# Altium schematic sheet Sheet1.SchDoc
size A3
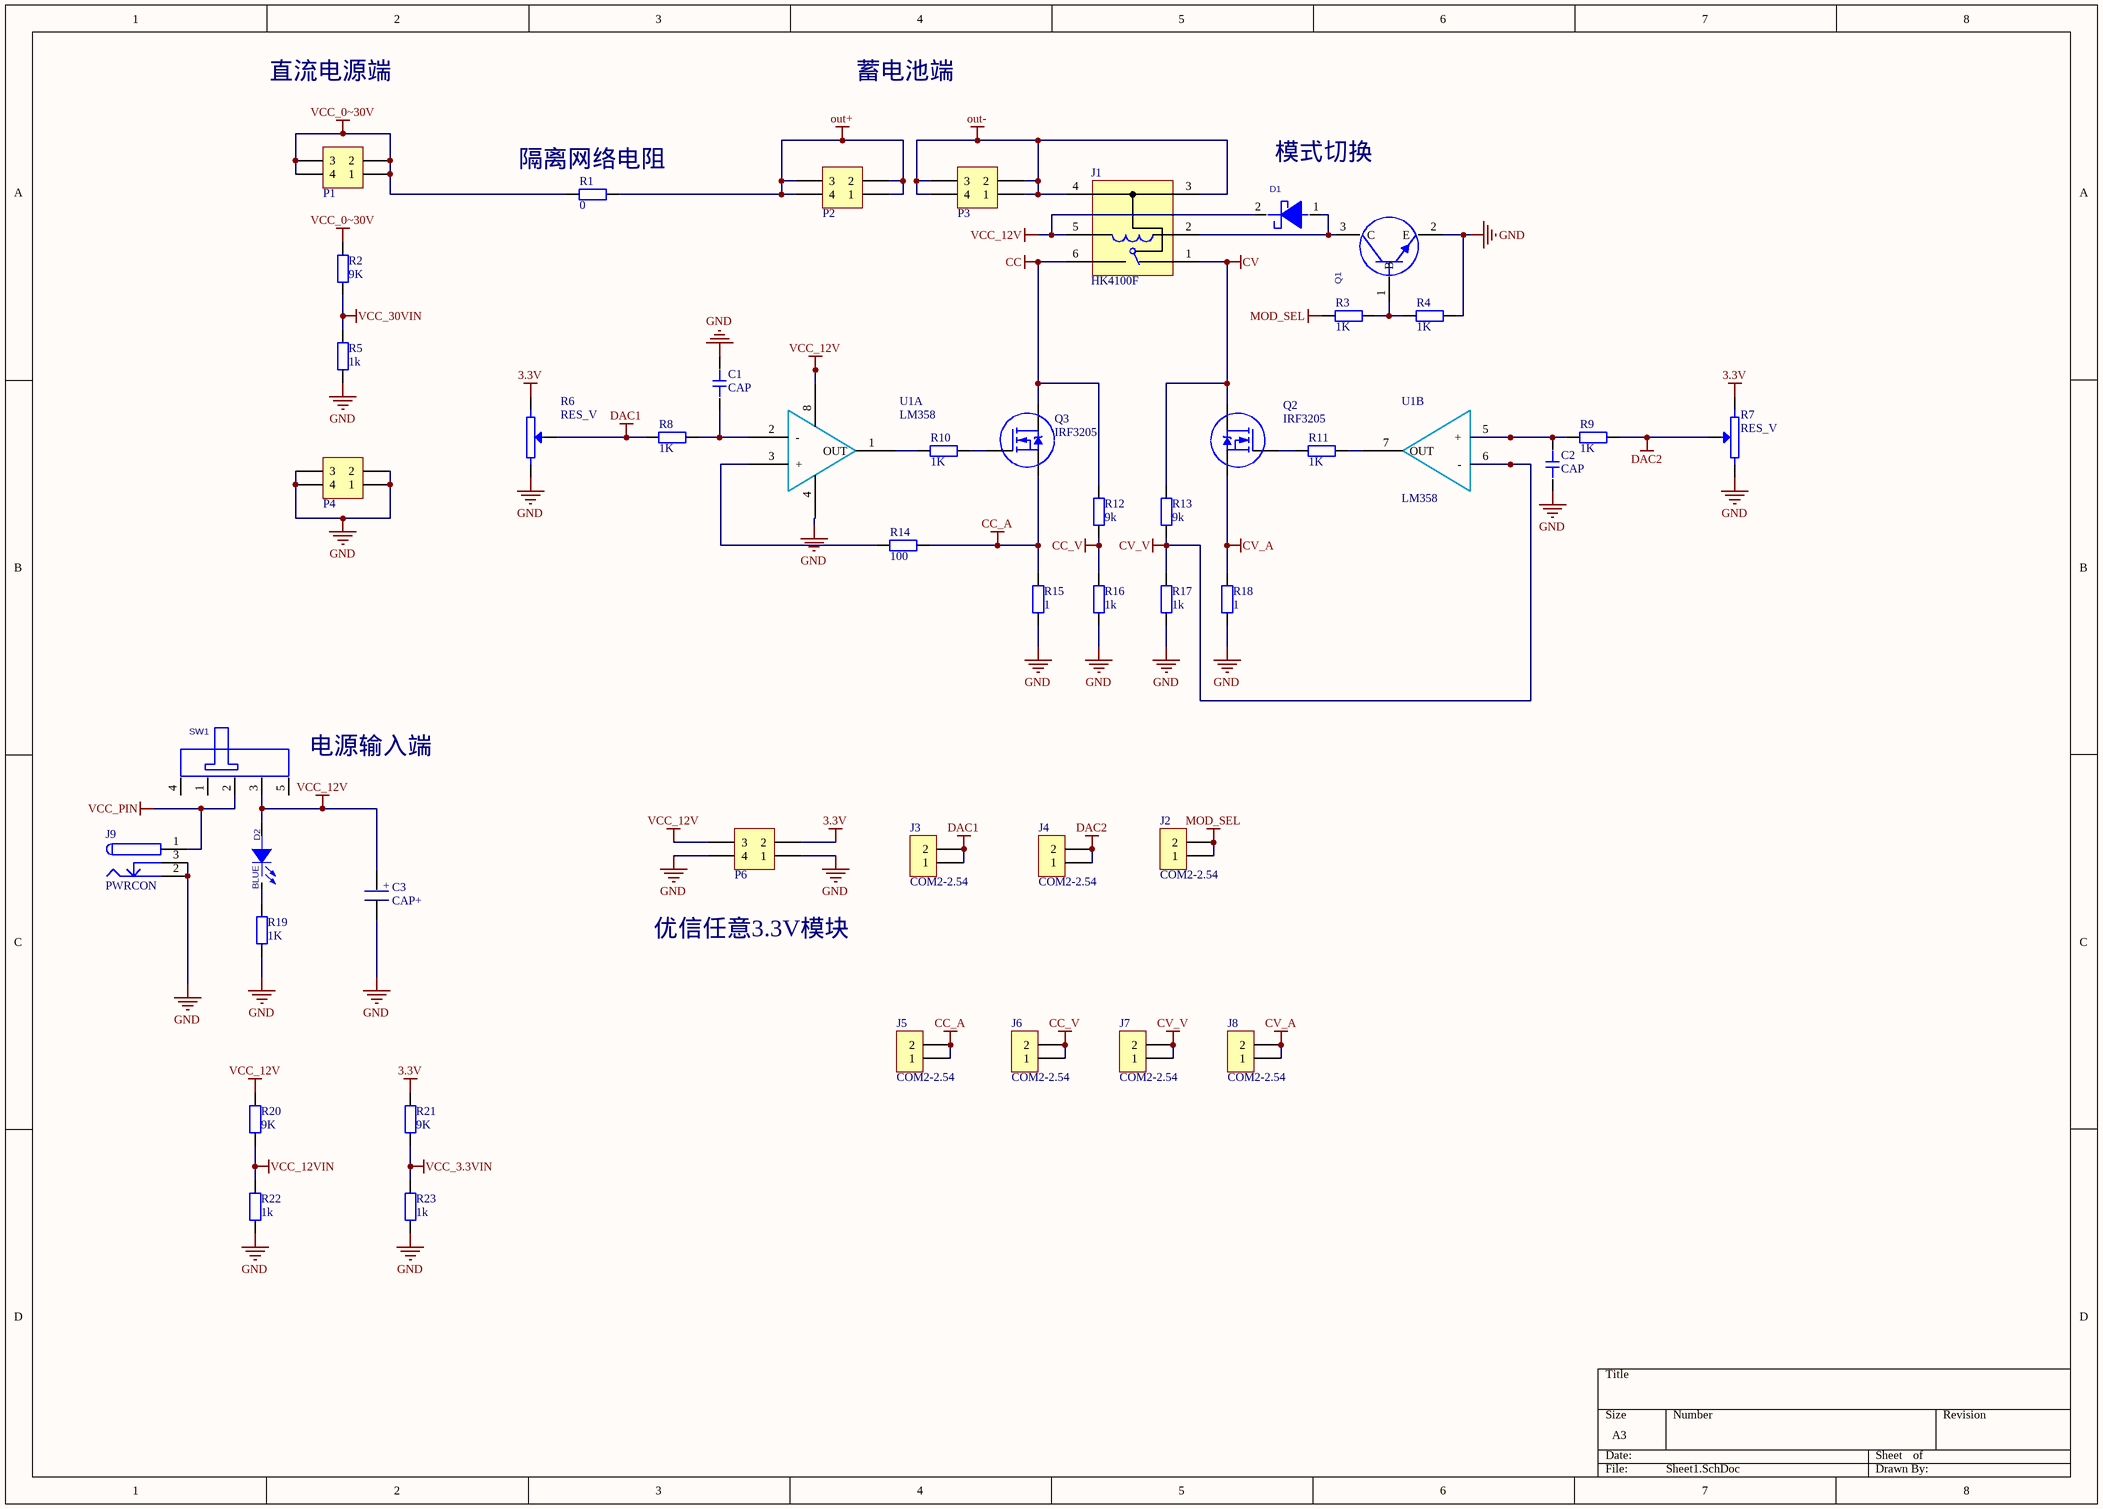
[diagram p0: Sheet1.SchDoc]

## Parts
C1  CAP  [C_0805]
C2  CAP  [C_0805]
C3  CAP+  [CAP_2]
D1  SMAJ5.0CA  [DO-214-A]  (value not drawn)
D2  value BLUE  [LED_0603]  (hidden comment: LED)
J1  HK4100F  [RELAY-HK4100F]
J2  COM2-2.54  [HDR2X1-2.54]
J3  COM2-2.54  [HDR2X1-2.54]
J4  COM2-2.54  [HDR2X1-2.54]
J5  COM2-2.54  [HDR2X1-2.54]
J6  COM2-2.54  [HDR2X1-2.54]
J7  COM2-2.54  [HDR2X1-2.54]
J8  COM2-2.54  [HDR2X1-2.54]
J9  PWRCON  [DC-005]
P1  Header 2X2A  [HDR2X2-2.54]  (value not drawn)
P2  Header 2X2A  [HDR2X2-2.54]  (value not drawn)
P3  Header 2X2A  [HDR2X2-2.54]  (value not drawn)
P4  Header 2X2A  [HDR2X2-2.54]  (value not drawn)
P6  Header 2X2A  [HDR2X2-2.54]  (value not drawn)
Q1  8050  [SOT-23]  (value not drawn)
Q2  IRF3205  [TO-220L]
Q3  IRF3205  [TO-220L]
R1  value 0  [1210]  (hidden comment: Res1)
R2  value 9K  [0603-1]  (hidden comment: Res1)
R3  value 1K  [0603-1]  (hidden comment: Res1)
R4  value 1K  [0603-1]  (hidden comment: Res1)
R5  value 1k  [0603-1]  (hidden comment: Res1)
R6  RES_V  [RES_V4]
R7  RES_V  [RES_V4]
R8  value 1K  [0603-1]  (hidden comment: Res1)
R9  value 1K  [0603-1]  (hidden comment: Res1)
R10  value 1K  [0603-1]  (hidden comment: Res1)
R11  value 1K  [0603-1]  (hidden comment: Res1)
R12  value 9k  [0603-1]  (hidden comment: Res1)
R13  value 9k  [0603-1]  (hidden comment: Res1)
R14  value 100  [1210]  (hidden comment: Res1)
R15  value 1  [1210]  (hidden comment: Res1)
R16  value 1k  [0603-1]  (hidden comment: Res1)
R17  value 1k  [0603-1]  (hidden comment: Res1)
R18  value 1  [1210]  (hidden comment: Res1)
R19  value 1K  [0603-1]  (hidden comment: Res1)
R20  value 9K  [0603-1]  (hidden comment: Res1)
R21  value 9K  [0603-1]  (hidden comment: Res1)
R22  value 1k  [0603-1]  (hidden comment: Res1)
R23  value 1k  [0603-1]  (hidden comment: Res1)
SW1  SW-POWER  [SW13_6]  (value not drawn)
U1  LM358  [SOP8]  (parts A,B of 2)

## Nets
3.3V: P6.2 R6.4 R7.4 R21.2
CC: J1.6 Q3.2(D) R12.2
CC_A: J5.1 J5.2 Q3.3(S) R14.1 R15.2
CC_V: J6.1 J6.2 R12.1 R16.2
CV: J1.1 Q2.2(D) R13.2
CV_A: J8.1 J8.2 Q2.3(S) R18.2
CV_V: J7.1 J7.2 R13.1 R17.2 U1.6(-)
DAC1: J3.1 J3.2 R6.5(W) R8.1
DAC2: J4.1 J4.2 R7.5(W) R9.2
GND: C1.2 C2.2 C3.2 J9.2 J9.3 P4.1 P4.2 P4.3 P4.4 P6.1 P6.4 Q1.2(E) R4.1 R5.1 R6.6 R7.6 R15.1 R16.1 R17.1 R18.1 R19.1 R22.1 R23.1 U1.4(-VCC)
MOD_SEL: J2.1 J2.2 R3.1
out+: P2.1 P2.2 P2.3 P2.4 R1.1
out-: J1.3 J1.4 P3.1 P3.2 P3.3 P3.4
VCC_0~30V: P1.1 P1.2 P1.3 P1.4 R1.2 R2.2
VCC_3.3VIN: R21.1 R23.2
VCC_12V: C3.1 D1.2(-) D2.1(ANODE) J1.5 P6.3 R20.2 SW1.3 U1.8(VCC)
VCC_12VIN: R20.1 R22.2
VCC_30VIN: R2.1 R5.2
VCC_PIN: J9.1 SW1.2
NetC1_1: C1.1 R8.2 U1.2(-)
NetC2_1: C2.1 R9.1 U1.5(+)
NetD1_1: D1.1(+) J1.2 Q1.3(C)
NetD2_2: D2.2(CATHODE) R19.2
NetQ1_1: Q1.1(B) R3.2 R4.2
NetQ2_1: Q2.1(G) R11.1
NetQ3_1: Q3.1(G) R10.2
NetR10_1: R10.1 U1.1(OUT)
NetR11_2: R11.2 U1.7(OUT)
NetR14_2: R14.2 U1.3(+)

Not connected (* = marked no-connect by the designer): SW1 1 4 5

## Notes on the sheet
- 直流电源端
- 蓄电池端
- (near R1) 隔离网络电阻
- (near D1) 模式切换
- (near SW1) 电源输入端
- 优信任意3.3V模块
- (in symbol CAP+) +

## Library data of the parts
D1 = SMAJ5.0CA: SMAJ5.0CA-E3/61 400W 5V; PCB DECAL: DO-214; Manufacture 1 P/N: SMAJ5.0CA; Value: SMAJ5.0CA
J1 = HK4100F: 单刀双掷继电器
J9 = PWRCON: 直流电源端子; Published: 17-Dec-2003; DatasheetDocument: 09-May-2002; Publisher: Altium Limited; ComponentLink1Description: Manufacturer Link; ComponentLink1URL: http://domino.kycon.com/internet/Products.html
P1-P4 P6 = Header 2X2A: 接插件; LatestRevisionDate: 17-Jul-2002; LatestRevisionNote: Re-released for DXP Platform.; Publisher: Altium Limited
Q1 = 8050: NPN; Manufacturer #2: 8050; PCB DECAL: SOT-23
R1-R5 R8-R23 = Res1: 贴片电阻; Published: 8-Jun-2000; LatestRevisionDate: 17-Jul-2002; LatestRevisionNote: Re-released for DXP Platform.; PackageReference: AXIAL-0.4; Publisher: Altium Limited
SW1 = SW-POWER: SW-5; Manufacturer #1 PN: SW-5; PCB DECAL: SW13_6
D2 = LED: PCB DECAL: LED_0603